# Altium schematic sheet Input Cover Breakout.SchDoc
size B
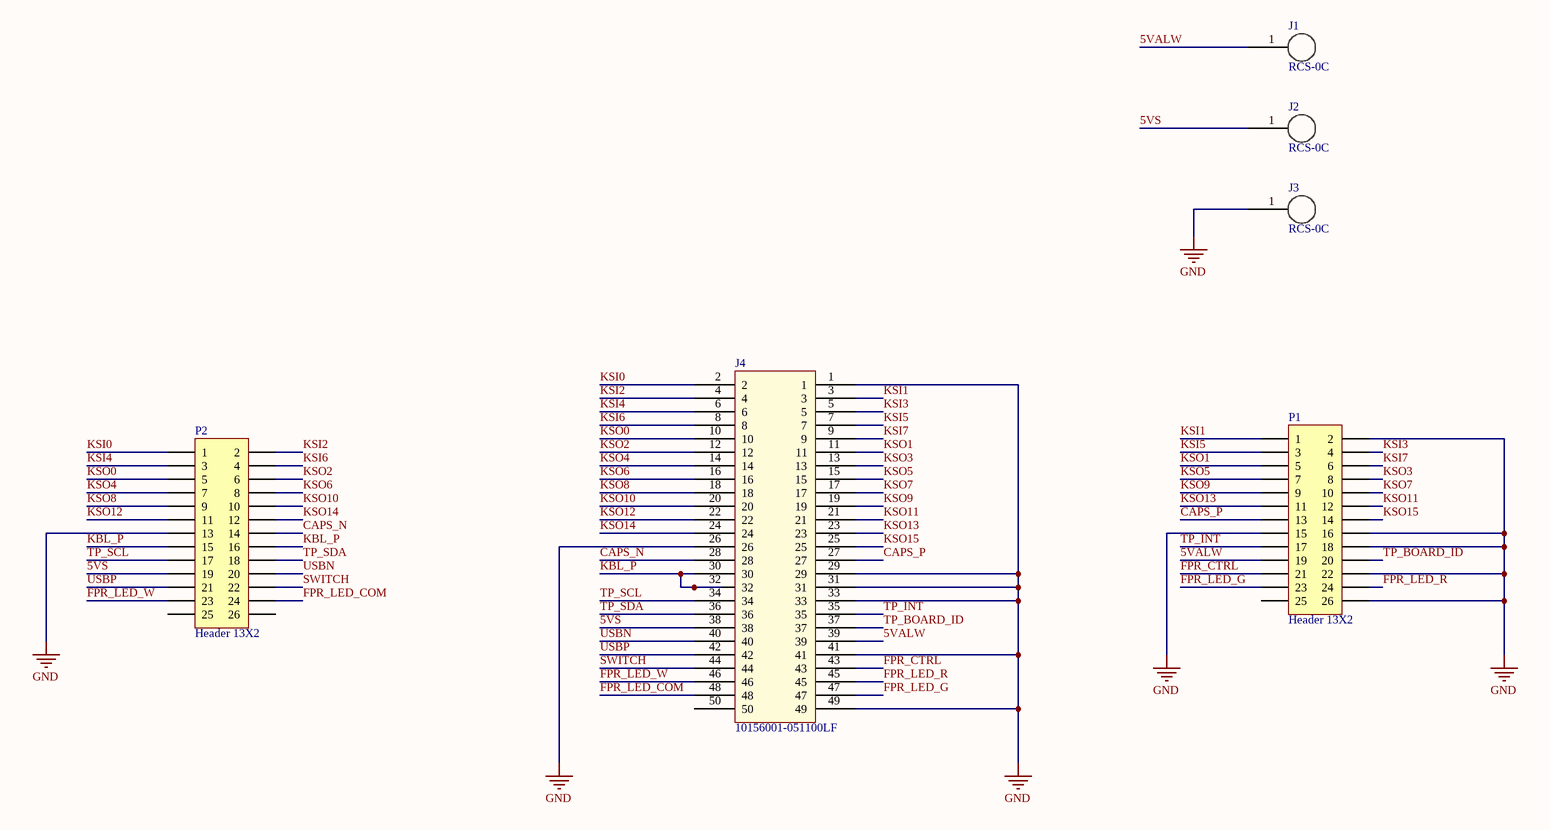
[diagram p0: Input Cover Breakout.SchDoc]

## Parts
J1  RCS-0C  [RCS-0C]
J2  RCS-0C  [RCS-0C]
J3  RCS-0C  [RCS-0C]
J4  10156001-051100LF  [10156001-051100LF]
P1  Header 13X2  [HDR2X13]
P2  Header 13X2  [HDR2X13]

## Nets
GND: J3.1 J4.1 J4.26 J4.29 J4.31 J4.33 J4.41 J4.49 P1.2 P1.15 P1.16 P1.18 P1.22 P1.26 P2.13
5VALW: J1.1 J4.39 P1.19
5VS: J2.1 J4.38 P2.19
CAPS_N: J4.28 P2.14
CAPS_P: J4.27 P1.13
FPR_CTRL: J4.43 P1.21
FPR_LED_COM: J4.48 P2.24
FPR_LED_G: J4.47 P1.23
FPR_LED_R: J4.45 P1.24
FPR_LED_W: J4.46 P2.23
KBL_P: J4.30 J4.32 P2.15 P2.16
KSI0: J4.2 P2.1
KSI1: J4.3 P1.1
KSI2: J4.4 P2.2
KSI3: J4.5 P1.4
KSI4: J4.6 P2.3
KSI5: J4.7 P1.3
KSI6: J4.8 P2.4
KSI7: J4.9 P1.6
KSO0: J4.10 P2.5
KSO1: J4.11 P1.5
KSO2: J4.12 P2.6
KSO3: J4.13 P1.8
KSO4: J4.14 P2.7
KSO5: J4.15 P1.7
KSO6: J4.16 P2.8
KSO7: J4.17 P1.10
KSO8: J4.18 P2.9
KSO9: J4.19 P1.9
KSO10: J4.20 P2.10
KSO11: J4.21 P1.12
KSO12: J4.22 P2.11
KSO13: J4.23 P1.11
KSO14: J4.24 P2.12
KSO15: J4.25 P1.14
SWITCH: J4.44 P2.22
TP_BOARD_ID: J4.37 P1.20
TP_INT: J4.35 P1.17
TP_SCL: J4.34 P2.17
TP_SDA: J4.36 P2.18
USBN: J4.40 P2.20
USBP: J4.42 P2.21

Not connected (* = marked no-connect by the designer): J4 50; P1 25; P2 25 26

## Library data of the parts
P1 P2 = Header 13X2: Header, 13-Pin, Dual row; LatestRevisionDate: 17-Jul-2002; LatestRevisionNote: Re-released for DXP Platform.; Publisher: Altium Limited